# Altium schematic sheet Ngu nghiep.SchDoc
size A
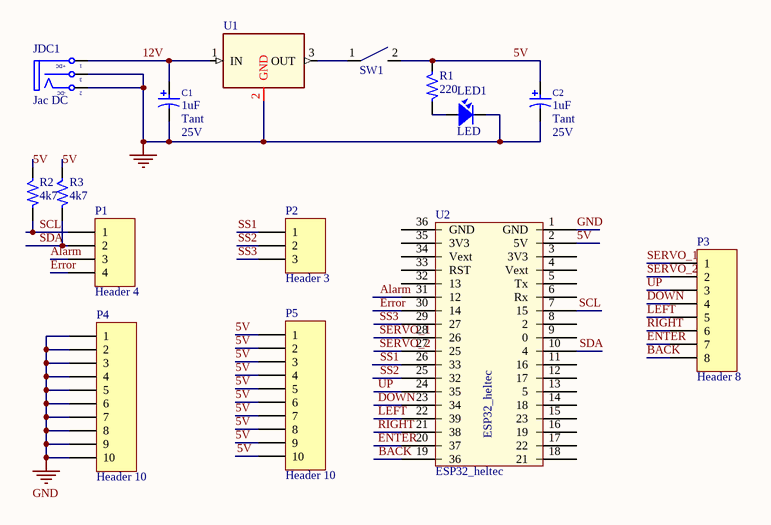
[diagram p0: Ngu nghiep.SchDoc]

## Parts
C1  Capacitor Type: Tant  Volt: 25V  [RADIAL B]  (hidden comment: 1uF)
C2  Capacitor Type: Tant  Volt: 25V  [RADIAL B]  (hidden comment: 1uF)
JDC1  Jac DC  [DC0]
LED1  LED  [LED-5-RED]
P1  Header 4  [HDR1X4]
P2  Header 3  [HDR1X3]
P3  Header 8  [HDR1X8]
P4  Header 10  [HDR1X10]
P5  Header 10  [HDR1X10]
R1  220  [RES-1/4W]
R2  4k7  [RES-1/4W]
R3  4k7  [RES-1/4W]
SW1  SW 2_BAP BENH_MH  [SW2_ BAP BENH]  (value not drawn)
U1  LM78xx  [TO-220]  (value not drawn)
U2  ESP32_heltec  [ESP32_WFK_Heltec]

## Nets
GND: C1.2 C2.2 JDC1.2(TN) JDC1.3(S) LED1.2 P4.1 P4.2 P4.3 P4.4 P4.5 P4.6 P4.7 P4.8 P4.9 P4.10 U1.2(GND) U2.1(GND)
5V: C2.1 P5.1 P5.2 P5.3 P5.4 P5.5 P5.6 P5.7 P5.8 P5.9 P5.10 R1.1 R2.1 R3.1 SW1.2 U2.2(5V)
12V: C1.1 JDC1.1(T) U1.1(IN)
Alarm: P1.3 U2.31(12)
BACK: P3.8 U2.19(36)
DOWN: P3.4 U2.23(34)
ENTER: P3.7 U2.20(37)
Error: P1.4 U2.30(14)
LEFT: P3.5 U2.22(39)
RIGHT: P3.6 U2.21(38)
SCL: P1.1 R2.2 U2.7(15)
SDA: P1.2 R3.2 U2.10(4)
SERVO_1: P3.1 U2.28(26)
SERVO_2: P3.2 U2.27(25)
SS1: P2.1 U2.26(33)
SS2: P2.2 U2.25(32)
SS3: P2.3 U2.29(27)
UP: P3.3 U2.24(35)
NetLED1_1: LED1.1 R1.2
NetSW1_1: SW1.1 U1.3(OUT)

Not connected (* = marked no-connect by the designer): U2 3(3V3) 4(Vext) 5(Tx) 6(Rx) 8(2) 9(0) 11(16) 12(17) 13(5) 14(18) 15(23) 16(19) 17(22) 18(21) 32(13) 33(RST) 34(Vext) 35(3V3) 36(GND)

## Notes on the sheet
- (in symbol DCIN) +DC; -DC

## Library data of the parts
C1 C2 = Cap_Pol: Polarized Capacitor; Manufacturer: FARNELL; AEMS Code: 2100110; Vendor: Digikey; Publisher: Hoang Nguyen; Value: 1uF; Published: 13-April-2009; ComponentLink1Description: Digikey Part Link; ComponentLink2Description: Open Datasheet; ComponentLink2URL: H:\LIBRARY\LIBRARY.Datasheet\
JDC1 = DCIN: Jac DC input; Value: Jac DC
LED1 = LED: LED Single colour Green and Red; Value: LED 3 ly Single Colour
P1 = Header 4: Header, 4-Pin; LatestRevisionDate: 17-Jul-2002; LatestRevisionNote: Re-released for DXP Platform.; Publisher: Altium Limited
P2 = Header 3: Header, 3-Pin; LatestRevisionDate: 17-Jul-2002; LatestRevisionNote: Re-released for DXP Platform.; Publisher: Altium Limited
P3 = Header 8: Header, 8-Pin; LatestRevisionDate: 17-Jul-2002; LatestRevisionNote: Re-released for DXP Platform.; Publisher: Altium Limited
P4 P5 = Header 10: Header, 10-Pin; LatestRevisionDate: 17-Jul-2002; LatestRevisionNote: Re-released for DXP Platform.; Publisher: Altium Limited
R1-R3 = R: Resistor 1/4W; Value: R1/4W - 1K
SW1 = SW 2_BAP BENH_MH: Công tắc bập bênh 2 chân MH001568
U1 = 78xx: Regulator; Manufacturer: Fairchild Semiconductor Corporation; PSpiceTemplate: X^@REFDES %IN %OUT %GND @MODEL; Vendor: Digikey; Output Current: Up to 1A; V out: 5V; Tolerance: 4 %; Value: LM7805CT; Published: 13-April-2009; Publisher: Hoang Nguyen; ComponentLink1Description: Digikey Part Link; ComponentLink2Description: Open Datasheet; ComponentLink2URL: H:\LIBRARY\LIBRARY.Datasheet\LM7805.pdf; Price: 2500 VND
U2 = ESP32_heltec: ESP32 IOT kit